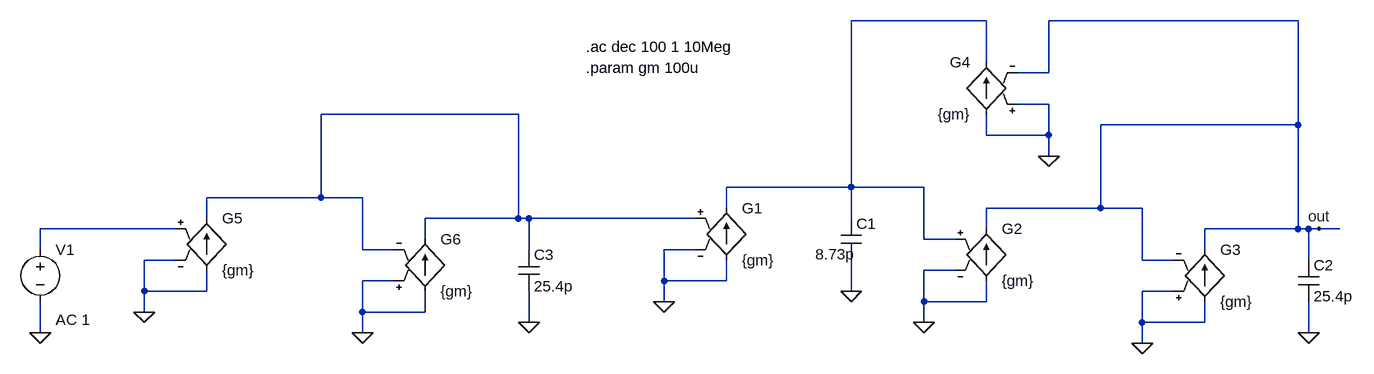
[diagram p0: schematic tb_FTJ_ord3_TowThomas_Gmideal.asc]
tb_FTJ_ord3_TowThomas_Gmideal.asc, the LTspice schematic file:
Version 4
SHEET 1 2700 1708
WIRE 1216 -96 1008 -96
WIRE 1696 -96 1312 -96
WIRE 1216 -32 1216 -96
WIRE 1312 -16 1312 -96
WIRE 1312 -16 1264 -16
WIRE 1312 32 1264 32
WIRE 496 48 192 48
WIRE 1696 64 1696 -96
WIRE 1696 64 1392 64
WIRE 1216 80 1216 48
WIRE 1312 80 1312 32
WIRE 1312 80 1216 80
WIRE 1312 112 1312 80
WIRE 1008 160 1008 -96
WIRE 1008 160 816 160
WIRE 1120 160 1008 160
WIRE 192 176 192 48
WIRE 192 176 16 176
WIRE 256 176 192 176
WIRE 816 192 816 160
WIRE 1392 192 1392 64
WIRE 1392 192 1216 192
WIRE 1456 192 1392 192
WIRE 16 208 16 176
WIRE 496 208 496 48
WIRE 496 208 352 208
WIRE 512 208 496 208
WIRE 768 208 512 208
WIRE 1008 208 1008 160
WIRE -32 224 -240 224
WIRE 1216 224 1216 192
WIRE 1696 224 1696 64
WIRE 1696 224 1552 224
WIRE 1712 224 1696 224
WIRE 1728 224 1712 224
WIRE 1760 224 1728 224
WIRE 352 240 352 208
WIRE 1120 240 1120 160
WIRE 1168 240 1120 240
WIRE -240 256 -240 224
WIRE 256 256 256 176
WIRE 304 256 256 256
WIRE 512 256 512 208
WIRE 768 256 720 256
WIRE 1552 256 1552 224
WIRE -32 272 -80 272
WIRE 1456 272 1456 192
WIRE 1504 272 1456 272
WIRE 1712 272 1712 224
WIRE 1168 288 1120 288
WIRE 304 304 256 304
WIRE 720 304 720 256
WIRE 816 304 816 272
WIRE 816 304 720 304
WIRE -80 320 -80 272
WIRE 16 320 16 288
WIRE 16 320 -80 320
WIRE 1008 320 1008 272
WIRE 1504 320 1456 320
WIRE 720 336 720 304
WIRE 1120 336 1120 288
WIRE 1216 336 1216 304
WIRE 1216 336 1120 336
WIRE -80 352 -80 320
WIRE 256 352 256 304
WIRE 352 352 352 320
WIRE 352 352 256 352
WIRE 512 368 512 320
WIRE 1120 368 1120 336
WIRE 1456 368 1456 320
WIRE 1552 368 1552 336
WIRE 1552 368 1456 368
WIRE -240 384 -240 336
WIRE 256 384 256 352
WIRE 1712 384 1712 336
WIRE 1456 400 1456 368
FLAG -240 384 0
FLAG 1728 224 out
FLAG 720 336 0
FLAG 1712 384 0
FLAG 1008 320 0
FLAG 1120 368 0
FLAG 1456 400 0
FLAG 512 368 0
FLAG -80 352 0
FLAG 256 384 0
FLAG 1312 112 0
SYMBOL voltage -240 240 R0
WINDOW 123 24 124 Left 2
WINDOW 39 0 0 Left 2
SYMATTR Value2 AC 1
SYMATTR InstName V1
SYMATTR Value ""
SYMBOL cap 992 208 R0
WINDOW 3 -39 55 Left 2
SYMATTR Value 8.73p
SYMATTR InstName C1
SYMBOL cap 1696 272 R0
SYMATTR InstName C2
SYMATTR Value 25.4p
SYMBOL g 816 176 R0
SYMATTR InstName G1
SYMATTR Value {gm}
SYMBOL g 1216 208 R0
SYMATTR InstName G2
SYMATTR Value {gm}
SYMBOL cap 496 256 R0
SYMATTR InstName C3
SYMATTR Value 25.4p
SYMBOL g 16 192 R0
SYMATTR InstName G5
SYMATTR Value {gm}
SYMBOL g2 1552 240 R0
SYMATTR InstName G3
SYMATTR Value {gm}
SYMBOL g2 352 224 R0
SYMATTR InstName G6
SYMATTR Value {gm}
SYMBOL g2 1216 -48 M0
SYMATTR InstName G4
SYMATTR Value {gm}
TEXT 600 -56 Left 2 !.ac dec 100 1 10Meg
TEXT 600 -24 Left 2 !.param gm 100u

The netlist it stands for:
* tb_FTJ_ord3_TowThomas_Gmideal.asc
V1 N003 0 AC 1
C1 N001 0 8.73p
C2 out 0 25.4p
G1 0 N001 N002 0 {gm}
G2 0 out N001 0 {gm}
C3 N002 0 25.4p
G5 0 N002 N003 0 {gm}
G3 0 out 0 out {gm}
G6 0 N002 0 N002 {gm}
G4 0 N001 0 out {gm}
.ac dec 100 1 10Meg
.param gm 100u
.backanno
.end